# Altium schematic sheet 主控原理图.SchDoc
size A4
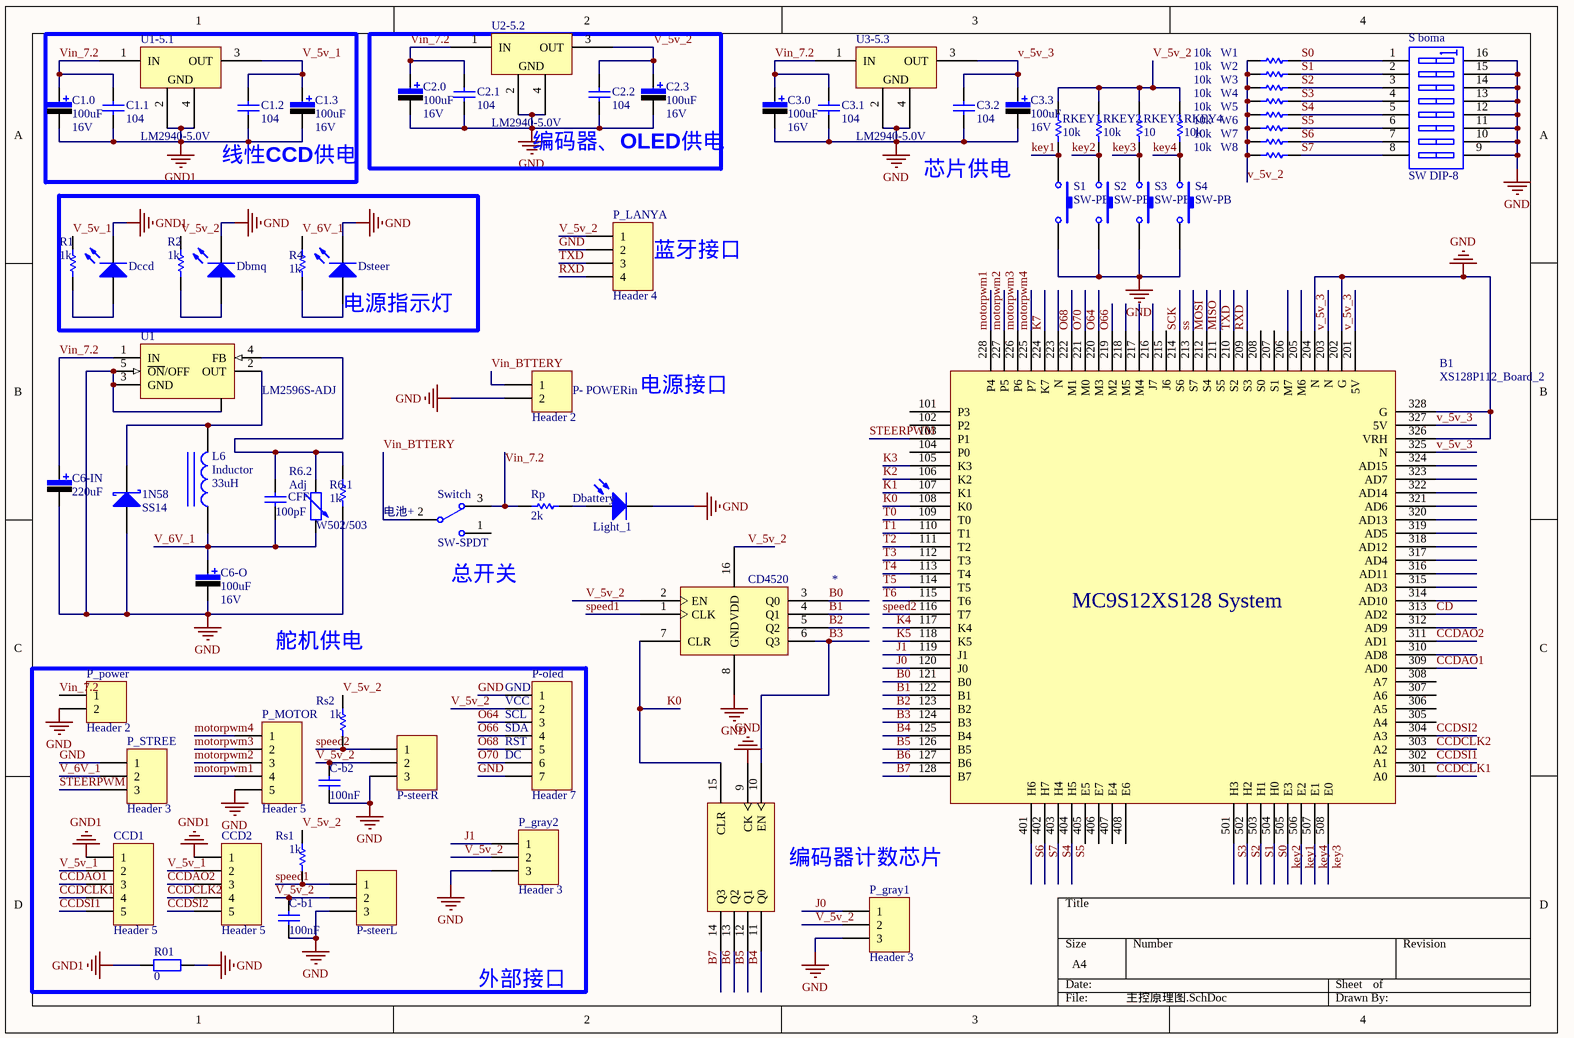
[diagram p0: 主控原理图.SchDoc]

## Parts
1N58  Type: SS14  [DIODE-SMA]  (hidden comment: D-Schottky)
*  CD4520  [DIP16]
B1  XS128P112_Board_2  [XS128P112_BOARD]
C1.0  value 100uF  Vol: 16V  [CAP-3528]  (hidden comment: Cap Pol)
C1.1  value 104  [0603-2]  (hidden comment: Cap)
C1.2  value 104  [0603-2]  (hidden comment: Cap)
C1.3  value 100uF  Vol: 16V  [CAP-3528]  (hidden comment: Cap Pol)
C2.0  value 100uF  Vol: 16V  [CAP-3528]  (hidden comment: Cap Pol)
C2.1  value 104  [0603-2]  (hidden comment: Cap)
C2.2  value 104  [0603-2]  (hidden comment: Cap)
C2.3  value 100uF  Vol: 16V  [CAP-3528]  (hidden comment: Cap Pol)
C3.0  value 100uF  Vol: 16V  [CAP-3528]  (hidden comment: Cap Pol)
C3.1  value 104  [0603-2]  (hidden comment: Cap)
C3.2  value 104  [0603-2]  (hidden comment: Cap)
C3.3  value 100uF  Vol: 16V  [CAP-3528]  (hidden comment: Cap Pol)
C6-IN  value 220uF  [C-RB-S6]  (hidden comment: Cap Pol)
C6-O  value 100uF  Vol: 16V  [CAP-3528]  (hidden comment: Cap Pol)
C-b1  value 100nF  [0603-2]  (hidden comment: Cap)
C-b2  value 100nF  [0603-2]  (hidden comment: Cap)
CCD1  Header 5  [HDR1X5]
CCD2  Header 5  [HDR1X5]
CFF  value 100pF  [C-RAD]  (hidden comment: Cap)
Dbattery  Light_1  [PIN2]
Dbmq  LED0  [LED_0805]  (value not drawn)
Dccd  LED0  [LED_0805]  (value not drawn)
Dsteer  LED0  [LED_0805]  (value not drawn)
L6  Inductor  value 33uH  [L-SMD-7]
P-_POWERin  Header 2  [JIEKOU]
P-oled  Header 7  [HDR1X7]
P-steerL  Header 3  [HDR3X1_A]  (value not drawn)
P-steerR  Header 3  [HDR3X1_A]  (value not drawn)
P_gray1  Header 3  [HDR1X3]
P_gray2  Header 3  [HDR1X3]
P_LANYA  Header 4  [HDR1X4]
P_MOTOR  Header 5  [HDR1X5]
P_power  Header 2  [JIEKOU]
P_STREE  Header 3  [HDR1X3]
R1  value 1k  [0603-2]  (hidden comment: Res1)
R01  value 0  [0603-2]  (hidden comment: Res1)
R2  value 1k  [0603-2]  (hidden comment: Res1)
R4  value 1k  [0603-2]  (hidden comment: Res1)
R6.1  value 1k  [0603-2]  (hidden comment: Res1)
R6.2  Adj  value W502/503  [PCBComponent_1]
RKEY1  value 10k  [0603-2]  (hidden comment: Res1)
RKEY2  value 10k  [0603-2]  (hidden comment: Res1)
RKEY3  value 10  [0603-2]  (hidden comment: Res1)
RKEY4  value 10k  [0603-2]  (hidden comment: Res1)
Rp  value 2k  [0603-2]  (hidden comment: Res1)
Rs1  value 1k  [0603-2]  (hidden comment: Res1)
Rs2  value 1k  [0603-2]  (hidden comment: Res1)
S1  SW-PB  [SW_PB2_A1]
S2  SW-PB  [SW_PB2_A1]
S3  SW-PB  [SW_PB2_A1]
S4  SW-PB  [SW_PB2_A1]
S_boma  SW DIP-8  [DIP_SW_8WAY_SMD]
Switch  SW-SPDT  [SWITCH_A1]
U1  LM2596S-ADJ  [TO-263-5]
U1-5.1  LM2940-5.0V  [SOT-223]
U2-5.2  LM2940-5.0V  [SOT-223]
U3-5.3  LM2940-5.0V  [SOT-223]
W1  value 10k  [0603-2]  (hidden comment: Res1)
W2  value 10k  [0603-2]  (hidden comment: Res1)
W3  value 10k  [0603-2]  (hidden comment: Res1)
W4  value 10k  [0603-2]  (hidden comment: Res1)
W5  value 10k  [0603-2]  (hidden comment: Res1)
W6  value 10k  [0603-2]  (hidden comment: Res1)
W7  value 10k  [0603-2]  (hidden comment: Res1)
W8  value 10k  [0603-2]  (hidden comment: Res1)

## Blocks framed on the sheet
线性CCD供电: C1.0-C1.3 U1-5.1
编码器、OLED供电: C2.0-C2.3 U2-5.2
电源指示灯: Dbmq Dccd Dsteer R1 R2 R4

## Nets
GND: 1N58.1(A) *.8(GND) *.9(CK) B1.202(G) B1.204(N) B1.326(VRH) B1.328(G) C2.0.2 C2.1.1 C2.2.1 C2.3.2 C3.0.2 C3.1.1 C3.2.1 C3.3.2 C6-IN.2 C6-O.2 C-b1.1 C-b2.1 Dbattery.2(K) Dbmq.2(K) Dsteer.2(K) P-_POWERin.2 P-oled.1 P-oled.7 P-steerL.3 P-steerR.3 P_gray1.3 P_gray2.3 P_LANYA.2 P_MOTOR.5 P_power.2 P_STREE.1 R01.2 R6.1.1 S1.2 S2.2 S3.2 S4.2 S_boma.9(B8) S_boma.10(B7) S_boma.11(B6) S_boma.12(B5) S_boma.13(B4) S_boma.14(B3) S_boma.15(B2) S_boma.16(B1) U1.3(GND) U1.5(~{ON}/OFF) U1.6 U2-5.2.2(GND) U2-5.2.4(GND) U3-5.3.2(GND) U3-5.3.4(GND)
GND1: C1.0.2 C1.1.1 C1.2.1 C1.3.2 CCD1.1 CCD2.1 Dccd.2(K) R01.1 U1-5.1.2(GND) U1-5.1.4(GND)
B0: *.3(Q0) B1.121(B0)
B1: *.4(Q1) B1.122(B1)
B2: *.5(Q2) B1.123(B2)
B3: *.6(Q3) *.10(EN) B1.124(B3)
B4: *.11(Q0) B1.125(B4)
B5: *.12(Q1) B1.126(B5)
B6: *.13(Q2) B1.127(B6)
B7: *.14(Q3) B1.128(B7)
CCDAO1: B1.309(AD0) CCD1.3
CCDAO2: B1.311(AD1) CCD2.3
CCDCLK1: B1.301(A0) CCD1.4
CCDCLK2: B1.303(A2) CCD2.4
CCDSI1: B1.302(A1) CCD1.5
CCDSI2: B1.304(A3) CCD2.5
CD: B1.313(AD2)
J0: B1.120(J0) P_gray1.1
J1: B1.119(J1) P_gray2.1
K0: *.7(CLR) *.15(CLR) B1.108(K0)
K1: B1.107(K1)
K2: B1.106(K2)
K3: B1.105(K3)
K4: B1.117(K4)
K5: B1.118(K5)
K7: B1.224(K7)
key1: B1.506(E2) RKEY1.2 S1.1
key2: B1.505(E3) RKEY2.2 S2.1
key3: B1.508(E0) RKEY3.2 S3.1
key4: B1.507(E1) RKEY4.2 S4.1
MISO: B1.211(S5)
MOSI: B1.212(S4)
motorpwm1: B1.228(P4) P_MOTOR.4
motorpwm2: B1.227(P5) P_MOTOR.3
motorpwm3: B1.226(P6) P_MOTOR.2
motorpwm4: B1.225(P7) P_MOTOR.1
O64: B1.220(M3) P-oled.3
O66: B1.219(M2) P-oled.4
O68: B1.222(M1) P-oled.5
O70: B1.221(M0) P-oled.6
RXD: B1.209(S3) P_LANYA.4
S0: B1.504(H0) S_boma.1(A1) W1.2
S1: B1.503(H1) S_boma.2(A2) W2.2
S2: B1.502(H2) S_boma.3(A3) W3.2
S3: B1.501(H3) S_boma.4(A4) W4.2
S4: B1.403(H4) S_boma.5(A5) W5.2
S5: B1.404(H5) S_boma.6(A6) W6.2
S6: B1.401(H6) S_boma.7(A7) W7.2
S7: B1.402(H7) S_boma.8(A8) W8.2
SCK: B1.214(S6)
speed1: *.1(CLK) P-steerL.1 Rs1.1
speed2: B1.116(T7) P-steerR.1 Rs2.1
ss: B1.213(S7)
STEERPWM: B1.103(P1) P_STREE.3
T0: B1.109(T0)
T1: B1.110(T1)
T2: B1.111(T2)
T3: B1.112(T3)
T4: B1.113(T4)
T5: B1.114(T5)
T6: B1.115(T6)
TXD: B1.210(S2) P_LANYA.3
V_5v_1: C1.2.2 C1.3.1 CCD1.2 CCD2.2 R1.2 U1-5.1.3(OUT)
V_5v_2: *.2(EN) *.16(VDD) C2.2.2 C2.3.1 C-b1.2 C-b2.2 P-oled.2 P-steerL.2 P-steerR.2 P_gray1.2 P_gray2.2 P_LANYA.1 R2.2 RKEY1.1 RKEY2.1 RKEY3.1 RKEY4.1 Rs1.2 Rs2.2 U2-5.2.3(OUT) W1.1 W2.1 W3.1 W4.1 W5.1 W6.1 W7.1 W8.1
v_5v_3: B1.201(5V) B1.203(N) B1.325(N) B1.327(5V) C3.2.2 C3.3.1 U3-5.3.3(OUT)
V_6V_1: C6-O.1 CFF.1 L6.1 P_STREE.2 R4.2 R6.2.2
Vin_7.2: C1.0.1 C1.1.2 C2.0.1 C2.1.2 C3.0.1 C3.1.2 C6-IN.1 P_power.1 Rp.2 Switch.3 U1.1(IN) U1-5.1.1(IN) U2-5.2.1(IN) U3-5.3.1(IN)
Vin_BTTERY: P-_POWERin.1 Switch.2
Net1N58_2: 1N58.2(K) L6.2 U1.2(OUT)
NetCFF_2: CFF.2 R6.1.2 R6.2.1 U1.4(FB)
NetDbattery_1: Dbattery.1(A) Rp.1
NetDbmq_1: Dbmq.1(A) R2.1
NetDccd_1: Dccd.1(A) R1.1
NetDsteer_1: Dsteer.1(A) R4.1

Not connected (* = marked no-connect by the designer): B1 101(P3) 102(P2) 104(P0) 205(M6) 206(M7) 207(S1) 208(S0) 215(J6) 216(J7) 217(M4) 218(M5) 223(N) 305(A4) 306(A5) 307(A6) 308(A7) 310(AD8) 312(AD9) 314(AD10) 315(AD3) 316(AD11) 317(AD4) 318(AD12) 319(AD5) 320(AD13) 321(AD6) 322(AD14) 323(AD7) 324(AD15) 405(E5) 406(E7) 407(E4) 408(E6); Switch 1

## Notes on the sheet
- 芯片供电
- (near P_LANYA) 蓝牙接口
- 电源接口
- 电池+
- (near Switch) 总开关
- 舵机供电
- (near P-oled) GND
- (near P-oled) VCC
- (near P-oled) SCL
- (near P-oled) SDA
- (near P-oled) RST
- (near P-oled) DC
- (near *) 编码器计数芯片
- 外部接口
- (in symbol XS128P112_Board_2) MC9S12XS128 System

## Library data of the parts
1N58 = D-Schottky: 肖特基二极管; Published: 8-Jun-2000; LatestRevisionDate: 17-Jul-2002; LatestRevisionNote: Re-released for DXP Platform.; PackageReference: SMB; Publisher: Altium Limited; Code_JEDEC: DO-214-AA
C1.0 C1.3 C2.0 C2.3 C3.0 C3.3 C6-IN C6-O = Cap Pol: 极性电解电容; Published: 8-Jun-2000; LatestRevisionDate: 17-Jul-2002; LatestRevisionNote: Re-released for DXP Platform.; PackageReference: RB7.6-15; Publisher: Altium Limited
C1.1 C1.2 C2.1 C2.2 C3.1 C3.2 C-b1 C-b2 CFF = Cap: 无极性电容; Published: 8-Jun-2000; LatestRevisionDate: 17-Jul-2002; LatestRevisionNote: Re-released for DXP Platform.; PackageReference: RAD-0.3; Publisher: Altium Limited
CCD1 CCD2 P_MOTOR = Header 5: Header, 5-Pin; LatestRevisionDate: 17-Jul-2002; LatestRevisionNote: Re-released for DXP Platform.; Publisher: Altium Limited
Dbattery = Photo Sen: Photosensitive Diode; Published: 24-Mar-1999; LatestRevisionDate: 17-Jul-2002; LatestRevisionNote: Re-released for DXP Platform.; PackageReference: PIN2; Publisher: Altium Limited
Dbmq Dccd Dsteer = LED0: 发光二极管; Published: 8-Jun-2000; LatestRevisionDate: 08-Jul-2005; LatestRevisionNote: Mech Layer 1 removed.; PackageReference: LED-0; Publisher: Altium Limited
L6 = Inductor Iron: Magnetic-Core Inductor; Published: 24-Mar-1999; LatestRevisionDate: 17-Jul-2002; LatestRevisionNote: Re-released for DXP Platform.; PackageReference: AXIAL-0.9; Publisher: Altium Limited
P-_POWERin P_power = Header 2: Header, 2-Pin; LatestRevisionDate: 17-Jul-2002; LatestRevisionNote: Re-released for DXP Platform.; Publisher: Altium Limited
P-oled = Header 7: Header, 7-Pin; LatestRevisionDate: 17-Jul-2002; LatestRevisionNote: Re-released for DXP Platform.; Publisher: Altium Limited
P-steerL P-steerR = Header 3: 接插件; LatestRevisionDate: 17-Jul-2002; LatestRevisionNote: Re-released for DXP Platform.; Publisher: Altium Limited
P_gray1 P_gray2 P_STREE = Header 3: Header, 3-Pin; LatestRevisionDate: 17-Jul-2002; LatestRevisionNote: Re-released for DXP Platform.; Publisher: Altium Limited
P_LANYA = Header 4: Header, 4-Pin; LatestRevisionDate: 17-Jul-2002; LatestRevisionNote: Re-released for DXP Platform.; Publisher: Altium Limited
R1 R2 R4 R6.1 RKEY1-RKEY4 Rp Rs1 Rs2 W1-W8 = Res1: Resistor; Published: 8-Jun-2000; LatestRevisionDate: 17-Jul-2002; LatestRevisionNote: Re-released for DXP Platform.; PackageReference: AXIAL-0.3; Publisher: Altium Limited; PackageDescription: Axial Device, Thru-Hole; 2 Leads; 0.3 in Pin Spacing
R01 = Res1: 贴片电阻; Published: 8-Jun-2000; LatestRevisionDate: 17-Jul-2002; LatestRevisionNote: Re-released for DXP Platform.; PackageReference: AXIAL-0.4; Publisher: Altium Limited
R6.2 = Res Adj2: Variable Resistor; Set Position: 0.5; Published: 8-Jun-2000; LatestRevisionDate: 17-Jul-2002; LatestRevisionNote: Re-released for DXP Platform.; PackageReference: AXIAL-0.6; Publisher: Altium Limited; PackageDescription: Axial Device, Thru-Hole; 2 Leads; 0.6 in Pin Spacing
S1-S4 = SW-PB: 微动开关; Published: 24-Mar-1999; LatestRevisionDate: 17-Jul-2002; LatestRevisionNote: Re-released for DXP Platform.; PackageReference: SPST-2; Publisher: Altium Limited
S_boma = SW DIP-8: DIP Switch, 8 Position, SPST; Published: 24-Mar-1999; LatestRevisionDate: 17-Jul-2002; LatestRevisionNote: Re-released for DXP Platform.; PackageReference: DIP_SW_8WAY_SMD; Publisher: Altium Limited
Switch = SW-SPDT: 开关; Published: 24-Mar-1999; LatestRevisionDate: 17-Dec-2003; LatestRevisionNote: Schematic revised, PCB Footprint replaced.; DatasheetDocument: 05-Dec-2000; PackageReference: TL36WW15050; Publisher: Altium Limited; ComponentLink1Description: Manufacturer Link; ComponentLink1URL: http://www.apem.com
U1 = LM2596S-ADJ: 可调稳压芯片; Note: Tab is connected to GND; Published: 15-Apr-2002; DatasheetVersion: Dec-1997; PackageReference: TS5B; Publisher: Altium Limited; PackageDescription: D2-PAK; 5 Leads; Body 14.4 (inc. leads) x 10.4 mm (LxW max); ComponentLink1Description: Manufacturer Link; ComponentLink1URL: http://www.national.com/; ComponentLink2Description: Datasheet; ComponentLink2URL: http://www.national.com/ds.cgi/LM/LM2596.pdf; ComponentLink3Description: URL Link1; ComponentLink3URL: http://www.national.com/pf/LM/LM2596.html
U1-5.1 U2-5.2 U3-5.3 = LM2940: 5V稳压芯片